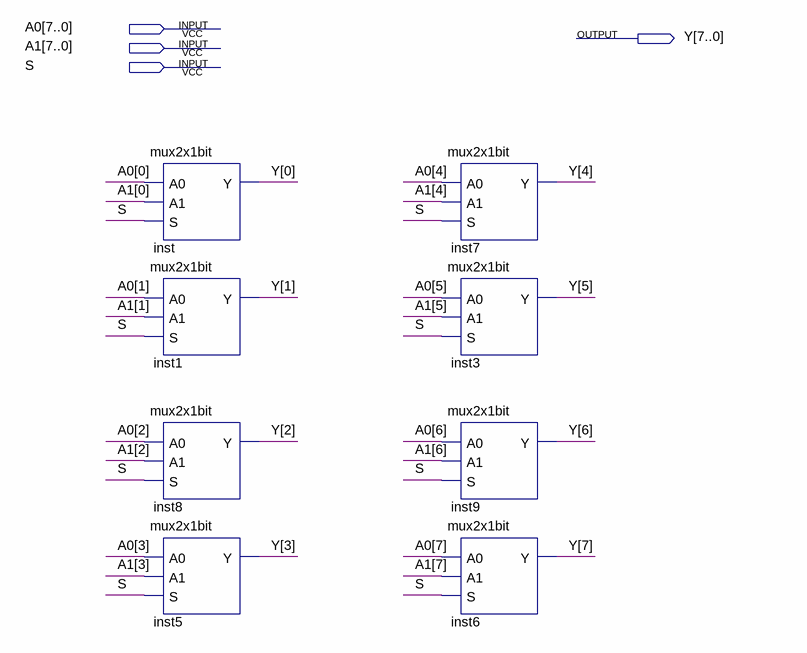
[diagram p0: schematic sheet]
// Quartus schematic mux2x8bit.bdf as structural Verilog: 8 symbols, 4 pins
module mux2x8bit (
  input  [7:0] A0,
  input  [7:0] A1,
  input  S,
  output [7:0] Y
);

  mux2x1bit inst (.A0(A0[0]), .A1(A1[0]), .S(S), .Y(Y[0]));
  mux2x1bit inst1 (.A0(A0[1]), .A1(A1[1]), .S(S), .Y(Y[1]));
  mux2x1bit inst8 (.A0(A0[2]), .A1(A1[2]), .S(S), .Y(Y[2]));
  mux2x1bit inst5 (.A0(A0[3]), .A1(A1[3]), .S(S), .Y(Y[3]));
  mux2x1bit inst7 (.A0(A0[4]), .A1(A1[4]), .S(S), .Y(Y[4]));
  mux2x1bit inst3 (.A0(A0[5]), .A1(A1[5]), .S(S), .Y(Y[5]));
  mux2x1bit inst9 (.A0(A0[6]), .A1(A1[6]), .S(S), .Y(Y[6]));
  mux2x1bit inst6 (.A0(A0[7]), .A1(A1[7]), .S(S), .Y(Y[7]));
endmodule
